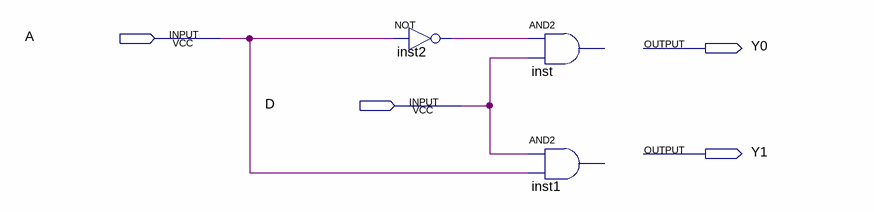
[diagram p0: schematic sheet]
// Quartus schematic 1to2Demux_Block_diagram.bdf as structural Verilog: 3 symbols, 4 pins
module \1to2Demux_Block_diagram  (
  input  A,
  input  D,
  output Y0,
  output Y1
);

  wire inst2_out;

  not inst2 (inst2_out, A);
  // AND2 inst has open pins: IN1=inst2_out, IN2=D, OUT=open
  // AND2 inst1 has open pins: IN1=D, IN2=A, OUT=open
endmodule
